# EAGLE design nrf24-breakout (EAGLE 7.4.0)
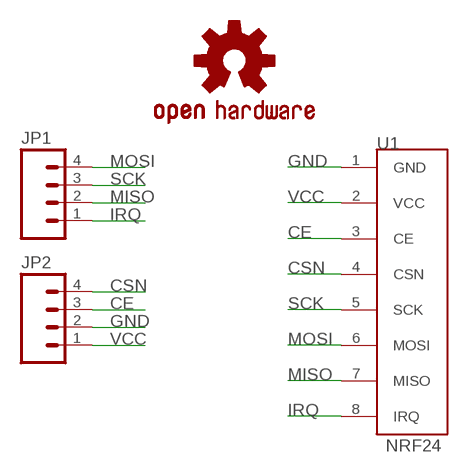
[diagram p0: schematic, sheet 1]

## Parts
JP1  M04NO_SILK_ALL_ROUND  [1X04_NO_SILK_ALL_ROUND]
JP2  M04NO_SILK_ALL_ROUND  [1X04_NO_SILK_ALL_ROUND]
LOGO1  OSHW-LOGOS  [OSHW-LOGO-S]
U1  NRF24  [NRF24]

## Nets
CE: JP2.3 U1.3(CE)
CSN: JP2.4 U1.4(CSN)
GND: JP2.2 U1.1(GND)
IRQ: JP1.1 U1.8(IRQ)
MISO: JP1.2 U1.7(MISO)
MOSI: JP1.4 U1.6(MOSI)
SCK: JP1.3 U1.5(SCK)
VCC: JP2.1 U1.2(VCC)

## Library data of the parts
JP1 JP2 = SparkFun-Connectors:M04: Header 4 Standard 4-pin 0.1" header. Use with straight break away headers (SKU : PRT-00116), right angle break away headers (PRT-00553), swiss pins (PRT-00743), machine pins (PRT-00117), and female headers (PRT-00115). Molex polarized connector foot print use with SKU : PRT-08231 with associated crimp pins and housings. 1MM SMD Version SKU: PRT-10208; PN: M20-9990446
LOGO1 = SparkFun-Aesthetics:OSHW-LOGO: Open Source Hardware Logo This logo indicates the piece of hardware it is found on incorporates a OSHW license and/or adheres to the definition of open source hardware found here: http://freedomdefined.org/OSHW
U1 = nrf24:NRF24; PN: M20-7830446

## Board
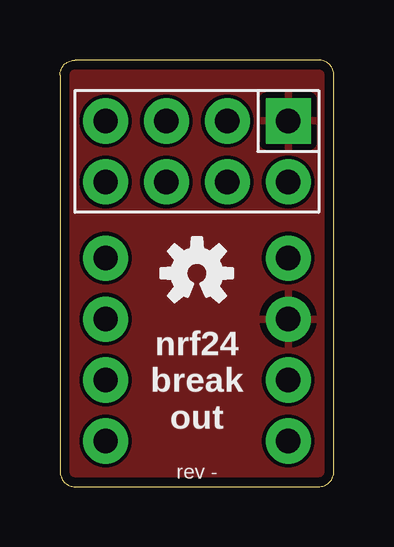
[diagram p1: board, top side]
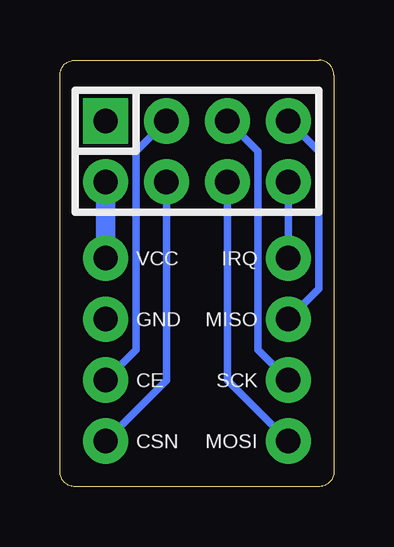
[diagram p2: board, bottom side, seen from below]

Size 11.43 x 17.78 mm. Coordinates in mm from the lower left corner, seen from the top.
Outline: 0,17.14 0,0.64 arc90 0.64,0 10.79,0 arc90 11.43,0.64 11.43,17.14 arc90 10.79,17.78 0.64,17.78 arc90 0,17.14
Copper layers (1*16): Top 0.0356mm / dielectric 1.5011mm / Bottom 0.0356mm
Design rules "LaenPCBOrder": minimum track width 6mil, minimum drill 13mil, track to track 6mil, track to pad 6mil, pad to pad 6mil, via to via 6mil, smd to smd 6mil, copper to edge 15mil, drill to drill 6mil, minimum pad ring 7mil, minimum via ring 7mil, stop-mask expansion 3mil, vias tented up to drill 0mil, thermal gap 10mil

### Footprints (pad centres in the part's own frame; a part is rotated, then mirrored left to right if it is on the bottom)
1X04_NO_SILK_ALL_ROUND = drill 1.016 pad 1.88: 1 0,0; 2 2.54,0; 3 5.08,0; 4 7.62,0
NRF24 = drill 1.016 pad 1.88 square: 1 3.81,1.27 | drill 1.016 pad 1.88: 2 3.81,-1.27; 3 1.27,1.27; 4 1.27,-1.27; 5 -1.27,1.27; 6 -1.27,-1.27; 7 -3.81,1.27; 8 -3.81,-1.27

### Placement (x,y rotation side)
JP1  1.91,9.53 270 top
JP2  9.53,9.53 270 top
LOGO1  5.71,8.89 0 top
U1  5.71,13.97 0 top

### Tracks (layer width: path | path; a pad name or v marks a point on that pad's centre or on a via)
CE
  Bottom 0.305: U1.3 8.26,13.97 8.26,5.71 JP2.3
CSN
  Bottom 0.305: U1.4 6.99,4.45 JP2.4
GND
  pour Top: -1.27,19.05 12.7,19.05 12.7,-1.27 -1.27,-1.27
IRQ
  Bottom 0.305: U1.8 JP1.1
MISO
  Bottom 0.305: U1.7 0.64,13.97 0.64,8.26 JP1.2
MOSI
  Bottom 0.305: U1.6 4.45,4.45 JP1.4
SCK
  Bottom 0.305: U1.5 3.17,13.97 3.17,5.71 JP1.3
VCC
  Bottom 0.813: U1.2 JP2.1

### Text on the board
tPlace: nrf24 / break / out | rev -
bPlace: IRQ | VCC | MISO | GND | SCK | CE | MOSI | CSN